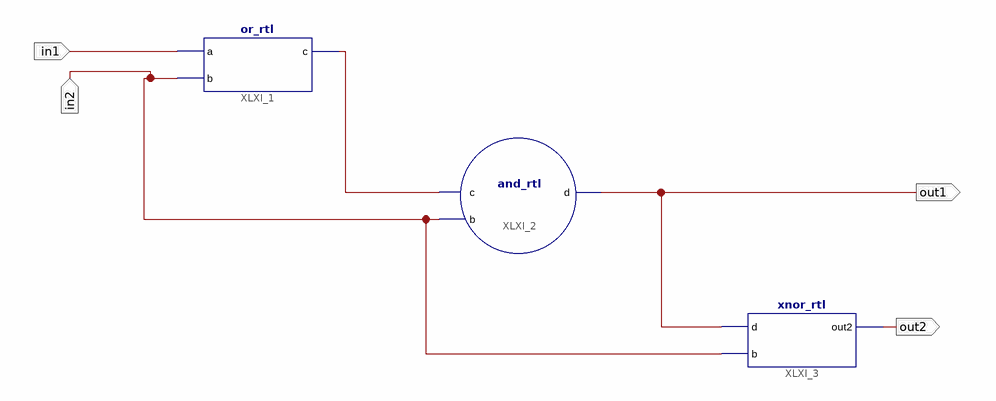
[diagram p0: schematic sheet 1]
// Xilinx ISE schematic circuit1_sch.sch (artix7) as structural Verilog: 3 symbols, 4 ports
module circuit1_sch (
  input  in1,
  input  in2,
  output out1,
  output out2
);

  wire XLXN_1;

  or_rtl XLXI_1 (.a(in1), .b(in2), .c(XLXN_1));
  and_rtl XLXI_2 (.c(XLXN_1), .b(in2), .d(out1));
  xnor_rtl XLXI_3 (.d(out1), .b(in2), .out2(out2));
endmodule
